# Altium schematic sheet IR_detector_16ch.SchDoc
size A3
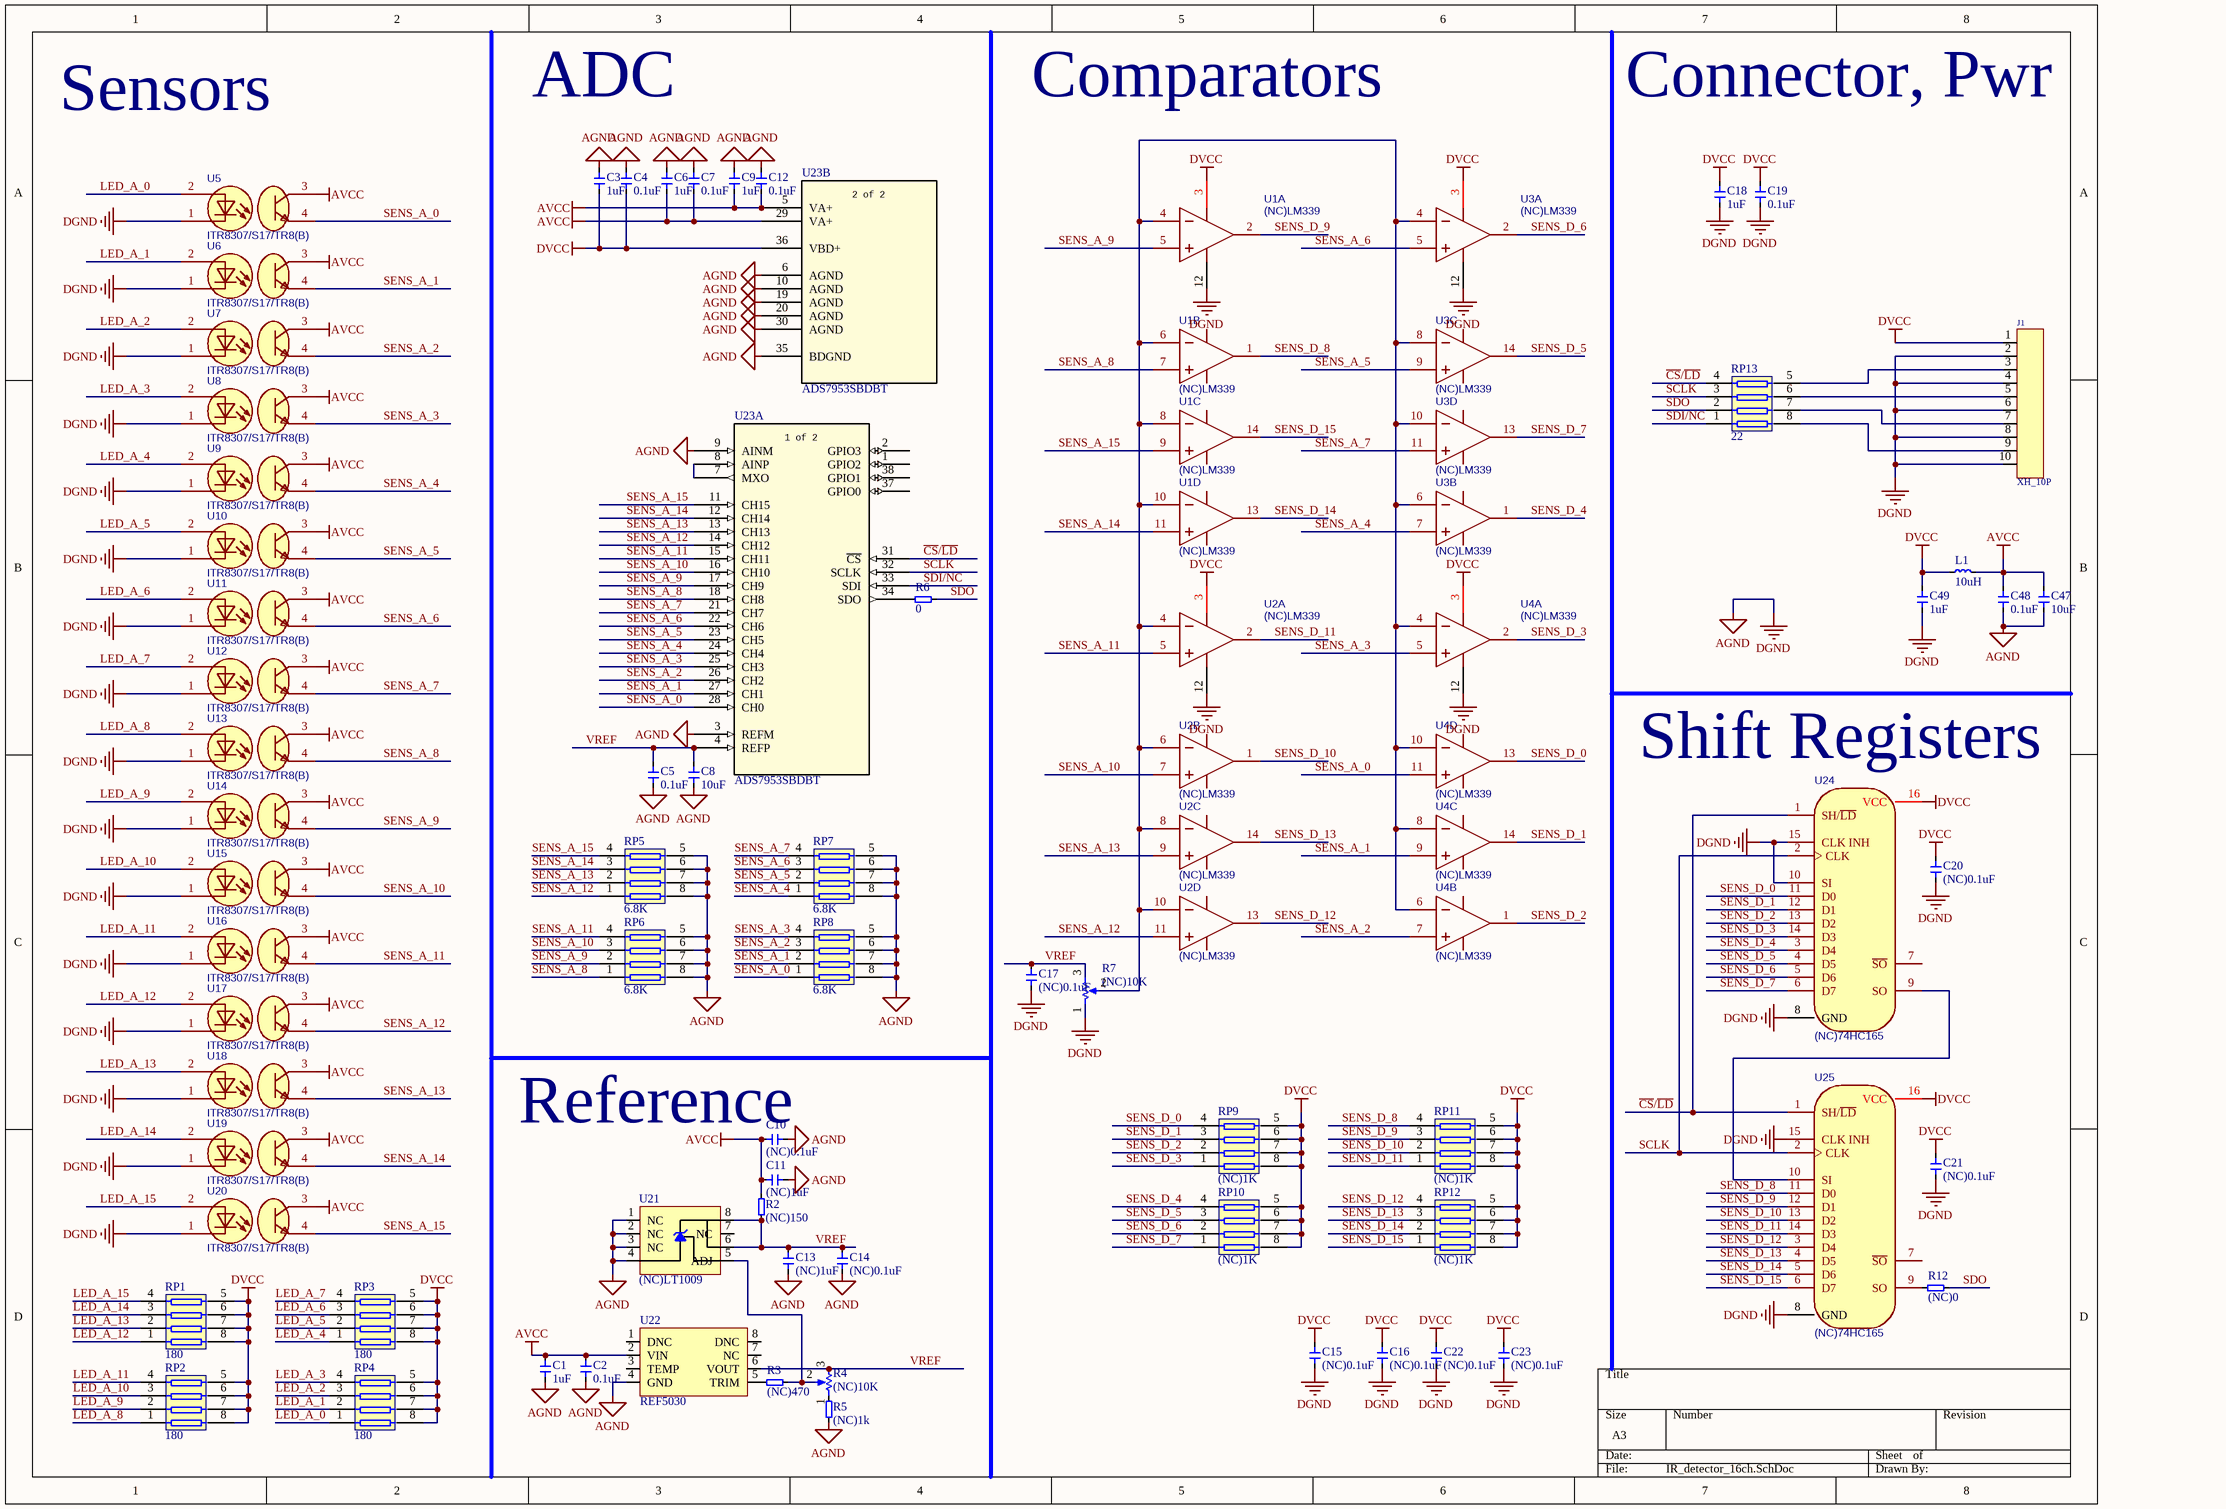
[diagram p0: IR_detector_16ch.SchDoc]

## Parts
C1  1uF  [0402]
C2  0.1uF  [0402]
C3  1uF  [0402]
C4  0.1uF  [0402]
C5  0.1uF  [0402]
C6  1uF  [0402]
C7  0.1uF  [0402]
C8  10uF  [0402]
C9  1uF  [0402]
C10  (NC)0.1uF  [0402]
C11  (NC)1uF  [0402]
C12  0.1uF  [0402]
C13  (NC)1uF  [0402]
C14  (NC)0.1uF  [0402]
C15  (NC)0.1uF  [0402]
C16  (NC)0.1uF  [0402]
C17  (NC)0.1uF  [0402]
C18  1uF  [0402]
C19  0.1uF  [0402]
C20  (NC)0.1uF  [0402]
C21  (NC)0.1uF  [0402]
C22  (NC)0.1uF  [0402]
C23  (NC)0.1uF  [0402]
C47  10uF  [0402]
C48  0.1uF  [0402]
C49  1uF  [0402]
J1  XH_10P  [XH_10P直插弯针]
L1  10uH  [0603]
R2  (NC)150  [0402]
R3  (NC)470  [0402]
R4  (NC)10K  [3x3_ResPot]
R5  (NC)1k  [0402]
R6  0  [0402]
R7  (NC)10K  [3362W-TH_3P-L7.1-W6.9-P2.54-BL-BS]
R12  (NC)0  [0402]
RP1  180  [8P4R-0603]
RP2  180  [8P4R-0603]
RP3  180  [8P4R-0603]
RP4  180  [8P4R-0603]
RP5  6.8K  [8P4R-0603]
RP6  6.8K  [8P4R-0603]
RP7  6.8K  [8P4R-0603]
RP8  6.8K  [8P4R-0603]
RP9  (NC)1K  [8P4R-0603]
RP10  (NC)1K  [8P4R-0603]
RP11  (NC)1K  [8P4R-0603]
RP12  (NC)1K  [8P4R-0603]
RP13  22  [8P4R-0603]
U1  (NC)LM339  [SOP-14_L8.6-W3.9-P1.27-LS6.0-BL]  (parts A,B,C,D of 4)
U2  (NC)LM339  [SOP-14_L8.6-W3.9-P1.27-LS6.0-BL]  (parts A,B,C,D of 4)
U3  (NC)LM339  [SOP-14_L8.6-W3.9-P1.27-LS6.0-BL]  (parts A,B,C,D of 4)
U4  (NC)LM339  [SOP-14_L8.6-W3.9-P1.27-LS6.0-BL]  (parts A,B,C,D of 4)
U5  ITR8307/S17/TR8(B)  [OPTO-SMD_ITR8307-S17-TR8-B-TS]
U6  ITR8307/S17/TR8(B)  [OPTO-SMD_ITR8307-S17-TR8-B-TS]
U7  ITR8307/S17/TR8(B)  [OPTO-SMD_ITR8307-S17-TR8-B-TS]
U8  ITR8307/S17/TR8(B)  [OPTO-SMD_ITR8307-S17-TR8-B-TS]
U9  ITR8307/S17/TR8(B)  [OPTO-SMD_ITR8307-S17-TR8-B-TS]
U10  ITR8307/S17/TR8(B)  [OPTO-SMD_ITR8307-S17-TR8-B-TS]
U11  ITR8307/S17/TR8(B)  [OPTO-SMD_ITR8307-S17-TR8-B-TS]
U12  ITR8307/S17/TR8(B)  [OPTO-SMD_ITR8307-S17-TR8-B-TS]
U13  ITR8307/S17/TR8(B)  [OPTO-SMD_ITR8307-S17-TR8-B-TS]
U14  ITR8307/S17/TR8(B)  [OPTO-SMD_ITR8307-S17-TR8-B-TS]
U15  ITR8307/S17/TR8(B)  [OPTO-SMD_ITR8307-S17-TR8-B-TS]
U16  ITR8307/S17/TR8(B)  [OPTO-SMD_ITR8307-S17-TR8-B-TS]
U17  ITR8307/S17/TR8(B)  [OPTO-SMD_ITR8307-S17-TR8-B-TS]
U18  ITR8307/S17/TR8(B)  [OPTO-SMD_ITR8307-S17-TR8-B-TS]
U19  ITR8307/S17/TR8(B)  [OPTO-SMD_ITR8307-S17-TR8-B-TS]
U20  ITR8307/S17/TR8(B)  [OPTO-SMD_ITR8307-S17-TR8-B-TS]
U21  (NC)LT1009  [SOP-8_L5.0-W4.0-P1.27-LS6.0-BL]
U22  REF5030  [VSSOP-8_L3.0-W3.0-P0.65-LS5.0-BL]
U23  ADS7953SBDBT  [TSSOP-38_L9.7-W4.4-P0.50-LS6.4-BL]  (parts A,B of 2)
U24  (NC)74HC165  [SOP-16_L10.0-W3.9-P1.27-LS6.0-BL]
U25  (NC)74HC165  [SOP-16_L10.0-W3.9-P1.27-LS6.0-BL]

## Nets
AGND: C1.1 C2.1 C3.2 C4.2 C5.1 C6.2 C7.2 C8.1 C9.2 C10.1 C11.1 C12.2 C13.1 C14.1 C15.1 C16.1 C17.1 C18.1 C19.1 C20.1 C21.1 C22.1 C23.1 C47.1 C48.1 C49.1 J1.2 J1.4 J1.6 J1.8 J1.10 R5.1 R7.1 RP5.5 RP5.6 RP5.7 RP5.8 RP6.5 RP6.6 RP6.7 RP6.8 RP7.5 RP7.6 RP7.7 RP7.8 RP8.5 RP8.6 RP8.7 RP8.8 U1.12(GND) U2.12(GND) U3.12(GND) U4.12(GND) U5.1 U6.1 U7.1 U8.1 U9.1 U10.1 U11.1 U12.1 U13.1 U14.1 U15.1 U16.1 U17.1 U18.1 U19.1 U20.1 U21.1(NC) U21.2(NC) U21.3(NC) U21.4(A) U22.4(GND) U23.3(REFM) U23.6(AGND) U23.9(AINM) U23.10(AGND) U23.19(AGND) U23.20(AGND) U23.30(AGND) U23.35(BDGND) U24.8(GND) U24.10(SI) U24.15(CLK_INH) U25.8(GND) U25.15(CLK_INH)  [also labelled DGND]
AVCC: C1.2 C2.2 C6.1 C7.1 C9.1 C10.2 C11.2 C12.1 C47.2 C48.2 L1.2 R2.2 U5.3 U6.3 U7.3 U8.3 U9.3 U10.3 U11.3 U12.3 U13.3 U14.3 U15.3 U16.3 U17.3 U18.3 U19.3 U20.3 U22.2(VIN) U23.5(VA+) U23.29(VA+)
DVCC: C3.1 C4.1 C15.2 C16.2 C18.2 C19.2 C20.2 C21.2 C22.2 C23.2 C49.2 J1.1 L1.1 RP1.5 RP1.6 RP1.7 RP1.8 RP2.5 RP2.6 RP2.7 RP2.8 RP3.5 RP3.6 RP3.7 RP3.8 RP4.5 RP4.6 RP4.7 RP4.8 RP9.5 RP9.6 RP9.7 RP9.8 RP10.5 RP10.6 RP10.7 RP10.8 RP11.5 RP11.6 RP11.7 RP11.8 RP12.5 RP12.6 RP12.7 RP12.8 U1.3(VCC) U2.3(VCC) U3.3(VCC) U4.3(VCC) U23.36(VBD+) U24.16(VCC) U25.16(VCC)
~{CS}/~{LD}: RP13.4 U23.31(~{CS}) U24.1(SH/~{LD}) U25.1(SH/~{LD})
LED_A_0: RP4.1 U5.2
LED_A_1: RP4.2 U6.2
LED_A_2: RP4.3 U7.2
LED_A_3: RP4.4 U8.2
LED_A_4: RP3.1 U9.2
LED_A_5: RP3.2 U10.2
LED_A_6: RP3.3 U11.2
LED_A_7: RP3.4 U12.2
LED_A_8: RP2.1 U13.2
LED_A_9: RP2.2 U14.2
LED_A_10: RP2.3 U15.2
LED_A_11: RP2.4 U16.2
LED_A_12: RP1.1 U17.2
LED_A_13: RP1.2 U18.2
LED_A_14: RP1.3 U19.2
LED_A_15: RP1.4 U20.2
SCLK: RP13.3 U23.32(SCLK) U24.2(CLK) U25.2(CLK)
SDI/NC: RP13.1 U23.33(SDI)
SDO: R6.2 R12.2 RP13.2
SENS_A_0: RP8.1 U4.11(IN4+) U5.4 U23.28(CH0)
SENS_A_1: RP8.2 U4.9(IN3+) U6.4 U23.27(CH1)
SENS_A_2: RP8.3 U4.7(IN2+) U7.4 U23.26(CH2)
SENS_A_3: RP8.4 U4.5(IN1+) U8.4 U23.25(CH3)
SENS_A_4: RP7.1 U3.7(IN2+) U9.4 U23.24(CH4)
SENS_A_5: RP7.2 U3.9(IN3+) U10.4 U23.23(CH5)
SENS_A_6: RP7.3 U3.5(IN1+) U11.4 U23.22(CH6)
SENS_A_7: RP7.4 U3.11(IN4+) U12.4 U23.21(CH7)
SENS_A_8: RP6.1 U1.7(IN2+) U13.4 U23.18(CH8)
SENS_A_9: RP6.2 U1.5(IN1+) U14.4 U23.17(CH9)
SENS_A_10: RP6.3 U2.7(IN2+) U15.4 U23.16(CH10)
SENS_A_11: RP6.4 U2.5(IN1+) U16.4 U23.15(CH11)
SENS_A_12: RP5.1 U2.11(IN4+) U17.4 U23.14(CH12)
SENS_A_13: RP5.2 U2.9(IN3+) U18.4 U23.13(CH13)
SENS_A_14: RP5.3 U1.11(IN4+) U19.4 U23.12(CH14)
SENS_A_15: RP5.4 U1.9(IN3+) U20.4 U23.11(CH15)
SENS_D_0: RP9.4 U4.13(OUT4) U24.11(D0)
SENS_D_1: RP9.3 U4.14(OUT3) U24.12(D1)
SENS_D_2: RP9.2 U4.1(OUT2) U24.13(D2)
SENS_D_3: RP9.1 U4.2(OUT1) U24.14(D3)
SENS_D_4: RP10.4 U3.1(OUT2) U24.3(D4)
SENS_D_5: RP10.3 U3.14(OUT3) U24.4(D5)
SENS_D_6: RP10.2 U3.2(OUT1) U24.5(D6)
SENS_D_7: RP10.1 U3.13(OUT4) U24.6(D7)
SENS_D_8: RP11.4 U1.1(OUT2) U25.11(D0)
SENS_D_9: RP11.3 U1.2(OUT1) U25.12(D1)
SENS_D_10: RP11.2 U2.1(OUT2) U25.13(D2)
SENS_D_11: RP11.1 U2.2(OUT1) U25.14(D3)
SENS_D_12: RP12.4 U2.13(OUT4) U25.3(D4)
SENS_D_13: RP12.3 U2.14(OUT3) U25.4(D5)
SENS_D_14: RP12.2 U1.13(OUT4) U25.5(D6)
SENS_D_15: RP12.1 U1.14(OUT3) U25.6(D7)
VREF: C5.2 C8.2 C13.2 C14.2 C17.2 R2.1 R4.3 R7.3 U21.6(K) U21.8(K) U22.6(VOUT) U23.4(REFP)
NetJ1_3: J1.3 RP13.5
NetJ1_5: J1.5 RP13.6
NetJ1_7: J1.7 RP13.7
NetJ1_9: J1.9 RP13.8
NetR3_1: R3.1 U22.5(TRIM)
NetR3_2: R3.2 R4.2 U21.5(ADJ)
NetR4_1: R4.1 R5.2
NetR6_1: R6.1 U23.34(SDO)
NetR7_2: R7.2 U1.4(IN1-) U1.6(IN2-) U1.8(IN3-) U1.10(IN4-) U2.4(IN1-) U2.6(IN2-) U2.8(IN3-) U2.10(IN4-) U3.4(IN1-) U3.6(IN2-) U3.8(IN3-) U3.10(IN4-) U4.4(IN1-) U4.6(IN2-) U4.8(IN3-) U4.10(IN4-)
NetR12_1: R12.1 U25.9(SO)
NetU23_7: U23.7(MXO) U23.8(AINP)
NetU24_9: U24.9(SO) U25.10(SI)

Not connected (* = marked no-connect by the designer): U21 7(NC); U22 1(DNC) 3(TEMP) 7(NC) 8(DNC); U23 1(GPIO2) 2(GPIO3) 37(GPIO0) 38(GPIO1); U24 7(~{SO}); U25 7(~{SO})

## Notes on the sheet
- ADC
- Comparators
- Connector, Pwr
- Sensors
- (near U24) Shift Registers
- (near C10) Reference
- (in symbol ADS7953SBDBT, part A) 1 of 2
- (in symbol ADS7953SBDBT, part B) 2 of 2

## Library data of the parts
C1-C23 C47-C49 = Cap
L1 = Inductor
R2 R3 R5 R6 R12 = Res: Resistor
R4 R7 = ResPot
RP1-RP13 = 8P4R_F
U1-U4 = LM339: BOM_Manufacturer: Gainsil; BOM_Manufacturer Part: LM339-SR; subpart_no: 1; BOM_Supplier: LCSC; BOM_Supplier Part: C431330; spicePre: U; spiceSymbolName: LM339-SR
U5-U20 = ITR8307/S17/TR8(B): BOM_Manufacturer: EVERLIGHT; BOM_Paste Type: expand; BOM_Supplier: LCSC; BOM_Manufacturer Part: ITR8307/S17/TR8(B); image: //image.lceda.cn/szlcsc/C81632.jpg; BOM_Supplier Part: C81632; spicePre: K; spiceSymbolName: ITR8307/S17/TR8(B)
U21 = LT1009-SOP8
U22 = REF50xx
U23 = ADS7953SBDBT: 12 bit, 1 MSPS, 16 ch, single ended, micro power, sr i/f, SAR ADC; Manufacturer: Texas Instruments; INDUSTRY_STD_PKG_TYPE: TSSOP; FAMILY_NAME: PRECISION ADC (<=10MSPS); PIN_COUNT: 38; PACKAGE_DESIGNATOR: DBT; Datasheet_URL: http://www.ti.com/lit/gpn/ADS7953; GENERIC_PART_NUMBER: ADS7953; Copyright: Copyright (C) 2018 Accelerated Designs. All rights reserved; RefDes: RefDes; Type: DEV
U24 U25 = 74_165: 8-bit parallel-in/serial-out shift register; spicePre: U; spiceSymbolName: HD74HC165FP